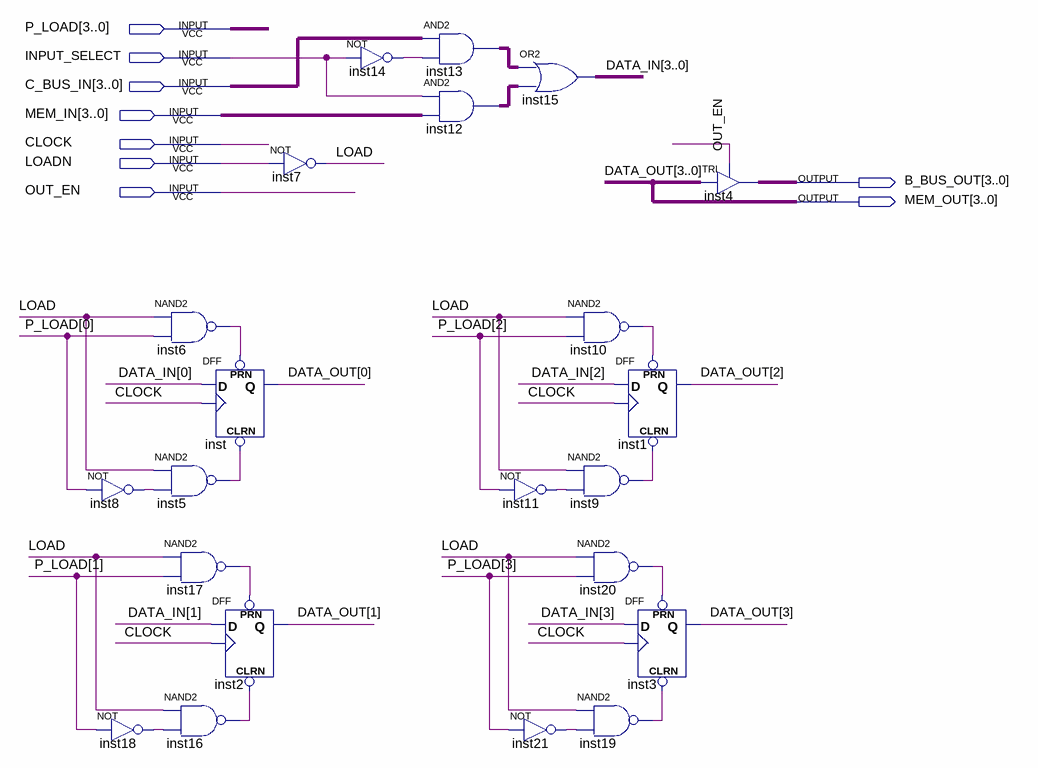
[diagram p0: schematic sheet]
// Quartus schematic register_4bit.bdf as structural Verilog: 22 symbols, 9 pins
module register_4bit (
  input  [3:0] P_LOAD,
  input  INPUT_SELECT,
  input  [3:0] C_BUS_IN,
  input  [3:0] MEM_IN,
  input  CLOCK,
  input  LOADN,
  input  OUT_EN,
  output [3:0] B_BUS_OUT,
  output [3:0] MEM_OUT
);

  wire inst5_out, inst6_out, inst8_out, inst9_out, inst10_out, inst11_out, inst14_out, inst16_out,
       inst17_out, inst18_out, inst19_out, inst20_out, inst21_out, LOAD;
  wire [3:0] DATA_IN, inst12_out, inst13_out;

  not inst8 (inst8_out, P_LOAD[0]);
  not inst18 (inst18_out, P_LOAD[1]);
  nand inst6 (inst6_out, LOAD, P_LOAD[0]);
  nand inst5 (inst5_out, LOAD, inst8_out);
  nand inst17 (inst17_out, LOAD, P_LOAD[1]);
  nand inst16 (inst16_out, LOAD, inst18_out);
  DFF inst (.CLRN(inst5_out), .CLK(CLOCK), .D(DATA_IN[0]), .PRN(inst6_out), .Q(MEM_OUT[0]));
  DFF inst2 (.CLRN(inst16_out), .CLK(CLOCK), .D(DATA_IN[1]), .PRN(inst17_out), .Q(MEM_OUT[1]));
  not inst7 (LOAD, LOADN);
  not inst14 (inst14_out, INPUT_SELECT);
  assign inst13_out = C_BUS_IN & {4{inst14_out}};  // AND2 inst13, 4 bits wide
  assign inst12_out = {4{INPUT_SELECT}} & MEM_IN;  // AND2 inst12, 4 bits wide
  assign DATA_IN = inst13_out | inst12_out;  // OR2 inst15, 4 bits wide
  not inst11 (inst11_out, P_LOAD[2]);
  not inst21 (inst21_out, P_LOAD[3]);
  nand inst10 (inst10_out, LOAD, P_LOAD[2]);
  DFF inst1 (.CLRN(inst9_out), .CLK(CLOCK), .D(DATA_IN[2]), .PRN(inst10_out), .Q(MEM_OUT[2]));
  nand inst9 (inst9_out, LOAD, inst11_out);
  nand inst20 (inst20_out, LOAD, P_LOAD[3]);
  DFF inst3 (.CLRN(inst19_out), .CLK(CLOCK), .D(DATA_IN[3]), .PRN(inst20_out), .Q(MEM_OUT[3]));
  nand inst19 (inst19_out, LOAD, inst21_out);
  TRI inst4[3:0] (.IN(MEM_OUT), .OE(OUT_EN), .OUT(B_BUS_OUT));

  // Other names for the same wires on the sheet: DATA_OUT[3:0] = MEM_OUT
endmodule
